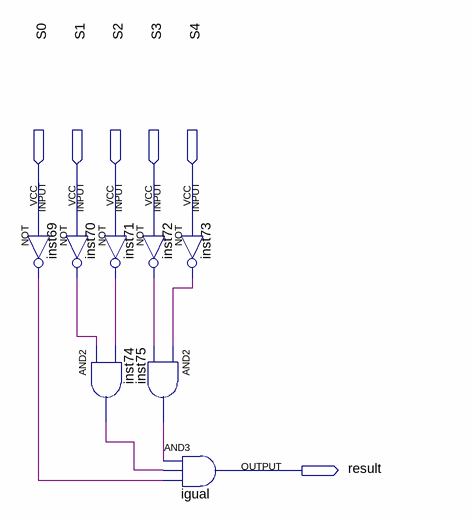
[diagram p0: schematic sheet]
// Quartus schematic Igual.bdf as structural Verilog: 8 symbols, 6 pins
module Igual (
  input  S0,
  input  S1,
  input  S2,
  input  S3,
  input  S4,
  output result
);

  wire inst69_out, inst70_out, inst71_out, inst72_out, inst73_out, inst74_out, inst75_out;

  not inst69 (inst69_out, S0);
  not inst70 (inst70_out, S1);
  not inst71 (inst71_out, S2);
  not inst72 (inst72_out, S3);
  and inst74 (inst74_out, inst70_out, inst71_out);
  and inst75 (inst75_out, inst73_out, inst72_out);
  not inst73 (inst73_out, S4);
  and igual (result, inst75_out, inst74_out, inst69_out);
endmodule
